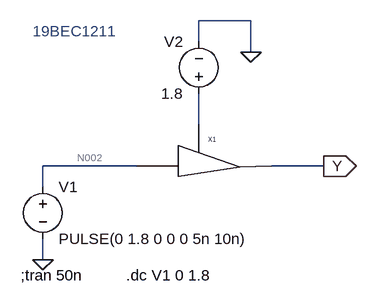
[diagram p0: schematic Buffer_test.asc]
Buffer_test.asc, the LTspice schematic file:
Version 4
SHEET 1 880 680
WIRE 272 -16 192 -16
WIRE 192 16 192 -16
WIRE 272 32 272 -16
WIRE 192 144 192 96
WIRE 96 208 -48 208
WIRE 384 208 304 208
WIRE -48 240 -48 208
WIRE -48 352 -48 320
FLAG 272 32 0
FLAG -48 352 0
FLAG 384 208 Y
IOPIN 384 208 Out
SYMBOL Buffer_Sym 192 208 R0
SYMATTR InstName X1
SYMBOL voltage -48 224 R0
SYMATTR InstName V1
SYMATTR Value PULSE(0 1.8 0 0 0 5n 10n)
SYMBOL voltage 192 112 R180
WINDOW 0 24 96 Left 2
WINDOW 3 24 16 Left 2
SYMATTR InstName V2
SYMATTR Value 1.8
TEXT -82 376 Left 2 !;tran 50n
TEXT -64 0 Left 2 ;19BEC1211
TEXT 80 376 Left 2 !.dc V1 0 1.8

The netlist it stands for:
* Buffer_test.asc
XX1 N001 Y N002 Buffer_Sym  ; pins VDD Vout Vin
V1 N002 0 PULSE(0 1.8 0 0 0 5n 10n)
V2 N001 0 1.8
;tran 50n
* 19BEC1211
.dc V1 0 1.8
.backanno
.end

* Results of the author's LTspice run, read from the files saved beside the schematic
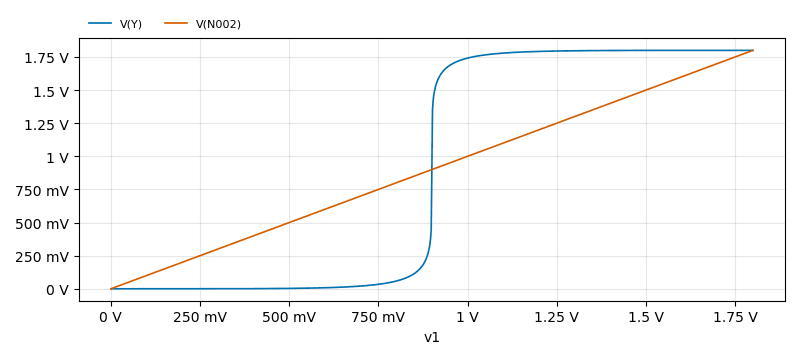
[diagram p1: DC transfer characteristic of Buffer_test.asc, plotted from the saved traces]
* DC transfer characteristic, 1 run:
*   V(Y): 100.3 nV at v1=0 V, 1.8 V at v1=1.8 V, min 100.3 nV, max 1.8 V
*   V(N002): 0 V at v1=0 V, 1.8 V at v1=1.8 V, min 0 V, max 1.8 V